# Altium project LP_LED_CUBE_8x8x8.PrjPcb
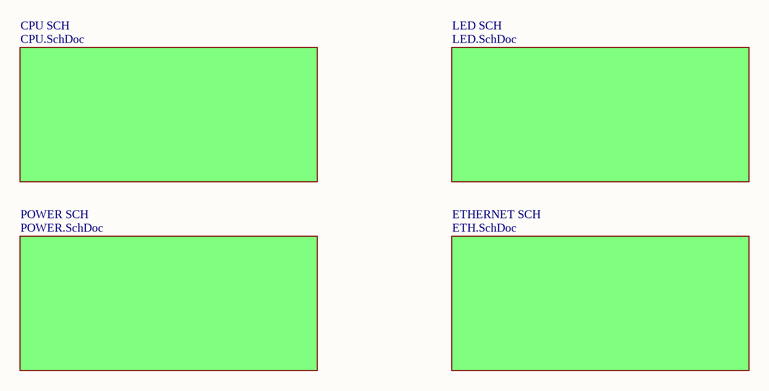
[diagram p0: LP_LED_CUBE_8x8x8.SchDoc]
Title: LED Cube 8x8x8
5 sheets, 171 parts. Net scope: global (net labels, ports and power ports of the same name join across sheets).
Board file: LP_LED_CUBE_8x8x8.PcbDoc
Sheets:
  LP_LED_CUBE_8x8x8.SchDoc
    CPU SCH = CPU.SchDoc
    LED SCH = LED.SchDoc
    POWER SCH = POWER.SchDoc
    ETHERNET SCH = ETH.SchDoc

## Sheet LP_LED_CUBE_8x8x8.SchDoc: LED Cube 8x8x8
size A4

### Sub-sheets
CPU SCH = CPU.SchDoc: no entries
ETHERNET SCH = ETH.SchDoc: no entries
LED SCH = LED.SchDoc: no entries
POWER SCH = POWER.SchDoc: no entries

## Sheet CPU.SchDoc: LED CUBE 8x8x8 - CPU
size A4; Author: Luka Penger; CompanyName: L. Penger; DrawnBy: Luka Penger; Organization: L. Penger; Address1: Luka Penger; Address2: http://lukapenger.eu; Address3: Software & Hardware; Address4: Development; DocumentNumber: 1; Revision: 1.0.0; SheetNumber: 1; SheetTotal: 4; DocumentName: CPU; ImagePath: I:\lp-led-cube-8x8x8\LP_LED_CUBE_8x8x8_PCB\ver_1.0.0; ProjectName: LED CUBE 8x8x8
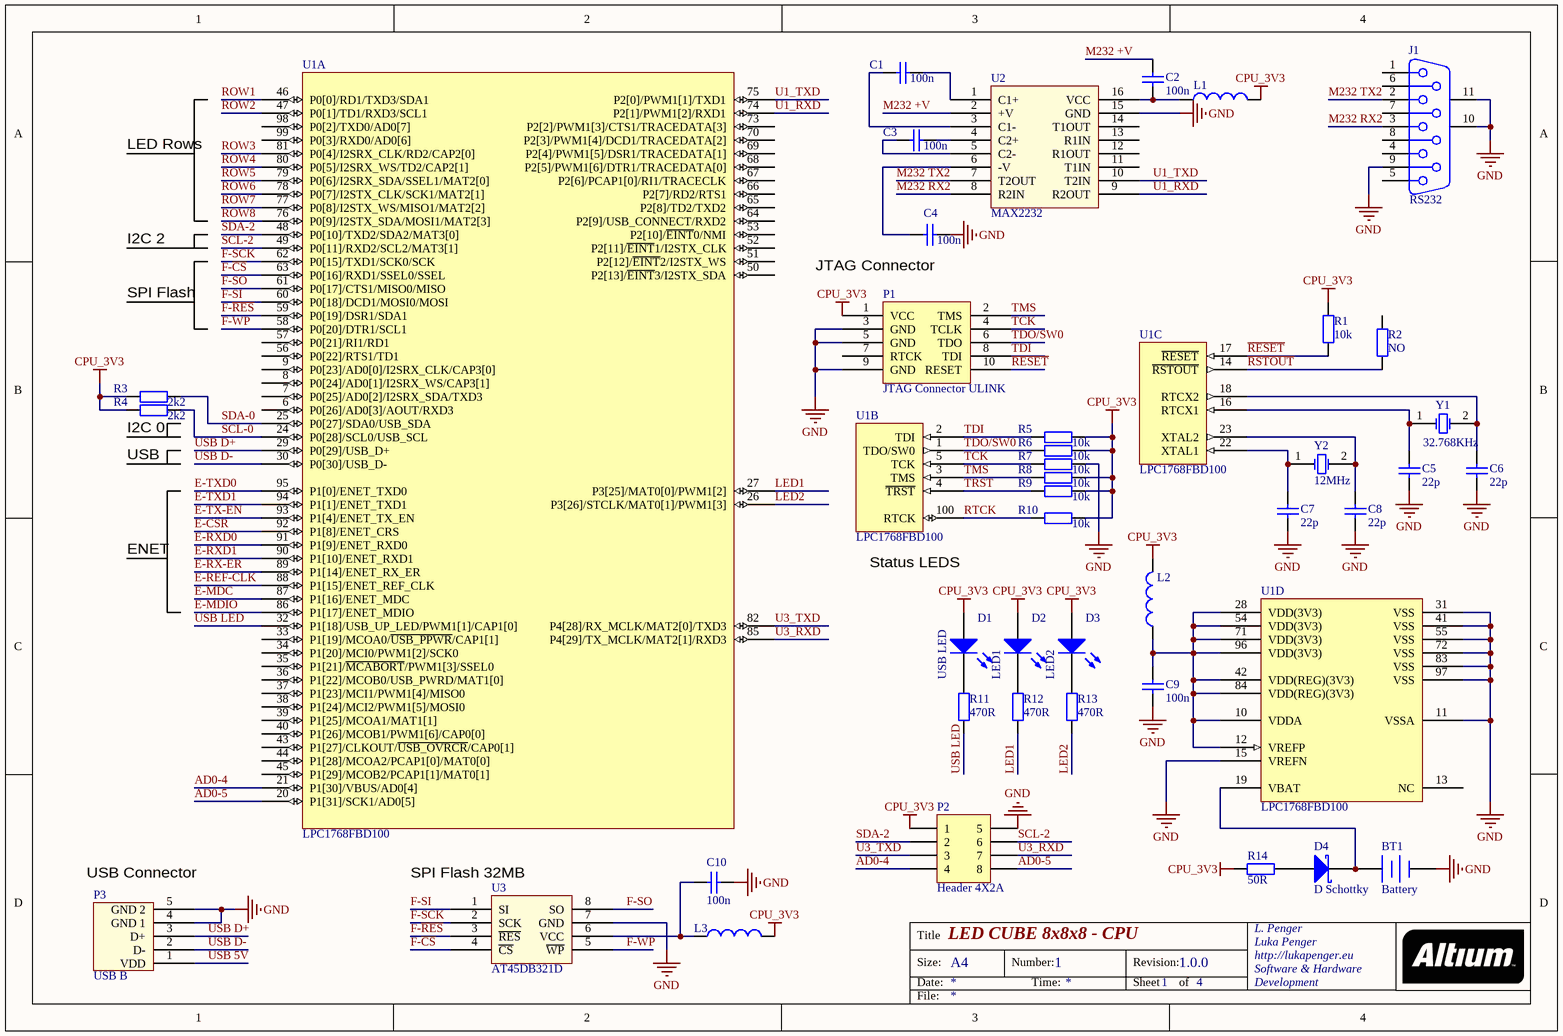
[diagram p1: CPU.SchDoc]

### Parts
BT1  Battery  [Battery CAP]
C1  100n  [1608[0603]]
C2  100n  [1608[0603]]
C3  100n  [1608[0603]]
C4  100n  [1608[0603]]
C5  22p  [1608[0603]]
C6  22p  [1608[0603]]
C7  22p  [1608[0603]]
C8  22p  [1608[0603]]
C9  100n  [1608[0603]]
C10  100n  [1608[0603]]
D1  USB LED  [LED-1]
D2  LED1  [LED-1]
D3  LED2  [LED-1]
D4  D Schottky  [SMB]
J1  RS232  [DSUB1.385-2H9]
L1  Inductor  [1608[0603]]  (value not drawn)
L2  Inductor  [1608[0603]]  (value not drawn)
L3  Inductor  [1608[0603]]  (value not drawn)
P1  JTAG Connector ULINK  [JTAG Connector ULINK]
P2  Header 4X2A  [HDR2X4_CEN]
P3  USB B  [USB B]
R1  10k  [1608[0603]]
R2  NO  [1608[0603]]
R3  2k2  [1608[0603]]
R4  2k2  [1608[0603]]
R5  10k  [1608[0603]]
R6  10k  [1608[0603]]
R7  10k  [1608[0603]]
R8  10k  [1608[0603]]
R9  10k  [1608[0603]]
R10  10k  [1608[0603]]
R11  470R  [1608[0603]]
R12  470R  [1608[0603]]
R13  470R  [1608[0603]]
R14  50R  [1608[0603]]
U1  LPC1768FBD100  [SOT407-1_N]  (parts A,B,C,D of 4)
U2  MAX2232  [SOIC16_N]
U3  AT45DB321D  [AT45DB321D]
Y1  32.768KHz  [Crystal 4.1x1.5]
Y2  12MHz  [5x3.2 Crystal]

### Nets
CPU_3V3: D1.1(A) D2.1(A) D3.1(A) L1.2 L2.2 L3.2 P1.1(VCC) P2.1 R1.2 R3.1 R4.1 R5.2 R6.2 R8.2 R9.2 R10.2 R14.2
GND: BT1.2(-) C4.1 C5.1 C6.1 C7.1 C8.1 C9.1 C10.1 J1.9 J1.10(MH1) J1.11(MH2) P1.3(GND) P1.5(GND) P1.9(GND) P2.5 P3.4(GND_1) P3.5(GND_2) R7.2 U1.11(VSSA) U1.15(VREFN) U1.31(VSS) U1.41(VSS) U1.55(VSS) U1.72(VSS) U1.83(VSS) U1.97(VSS) U2.15(GND) U3.7(GND)
AD0-4: P2.4 U1.21(P1[30]/VBUS/AD0[4])
AD0-5: P2.8 U1.20(P1[31]/SCK1/AD0[5])
E-CSR: U1.92(P1[8]/ENET_CRS)
E-MDC: U1.87(P1[16]/ENET_MDC)
E-MDIO: U1.86(P1[17]/ENET_MDIO)
E-REF-CLK: U1.88(P1[15]/ENET_REF_CLK)
E-RX-ER: U1.89(P1[14]/ENET_RX_ER)
E-RXD0: U1.91(P1[9]/ENET_RXD0)
E-RXD1: U1.90(P1[10]/ENET_RXD1)
E-TX-EN: U1.93(P1[4]/ENET_TX_EN)
E-TXD0: U1.95(P1[0]/ENET_TXD0)
E-TXD1: U1.94(P1[1]/ENET_TXD1)
F-~{CS}: U1.63(P0[16]/RXD1/SSEL0/SSEL) U3.4(~{CS})
F-~{RES}: U1.59(P0[19]/DSR1/SDA1) U3.3(~{RES})
F-SCK: U1.62(P0[15]/TXD1/SCK0/SCK) U3.2(SCK)
F-SI: U1.60(P0[18]/DCD1/MOSI0/MOSI) U3.1(SI)
F-SO: U1.61(P0[17]/CTS1/MISO0/MISO) U3.8(SO)
F-~{WP}: U1.58(P0[20]/DTR1/SCL1) U3.5(~{WP})
LED1: R12.1 U1.27(P3[25]/MAT0[0]/PWM1[2])
LED2: R13.1 U1.26(P3[26]/STCLK/MAT0[1]/PWM1[3])
M232 +V: C2.1 U2.2(+V)
M232 RX2: J1.3 U2.8(R2IN)
M232 TX2: J1.2 U2.7(T2OUT)
~{RESET}: P1.10(RESET) R1.1 U1.17(~{RESET})
~{RSTOUT}: R2.1 U1.14(~{RSTOUT})
ROW1: U1.46(P0[0]/RD1/TXD3/SDA1)
ROW2: U1.47(P0[1]/TD1/RXD3/SCL1)
ROW3: U1.81(P0[4]/I2SRX_CLK/RD2/CAP2[0])
ROW4: U1.80(P0[5]/I2SRX_WS/TD2/CAP2[1])
ROW5: U1.79(P0[6]/I2SRX_SDA/SSEL1/MAT2[0])
ROW6: U1.78(P0[7]/I2STX_CLK/SCK1/MAT2[1])
ROW7: U1.77(P0[8]/I2STX_WS/MISO1/MAT2[2])
ROW8: U1.76(P0[9]/I2STX_SDA/MOSI1/MAT2[3])
RTCK: R10.1 U1.100(RTCK)
SCL-0: R4.2 U1.24(P0[28]/SCL0/USB_SCL)
SCL-2: P2.6 U1.49(P0[11]/RXD2/SCL2/MAT3[1])
SDA-0: R3.2 U1.25(P0[27]/SDA0/USB_SDA)
SDA-2: P2.2 U1.48(P0[10]/TXD2/SDA2/MAT3[0])
TCK: P1.4(TCLK) R7.1 U1.5(TCK)
TDI: P1.8(TDI) R5.1 U1.2(TDI)
TDO/SW0: P1.6(TDO) R6.1 U1.1(TDO/SW0)
TMS: P1.2(TMS) R8.1 U1.3(TMS)
TRST: R9.1 U1.4(~{TRST})
U1_RXD: U1.74(P2[1]/PWM1[2]/RXD1) U2.9(R2OUT)
U1_TXD: U1.75(P2[0]/PWM1[1]/TXD1) U2.10(T2IN)
U3_RXD: P2.7 U1.85(P4[29]/TX_MCLK/MAT2[1]/RXD3)
U3_TXD: P2.3 U1.82(P4[28]/RX_MCLK/MAT2[0]/TXD3)
USB 5V: P3.1(VDD)
USB D+: P3.3(D+) U1.29(P0[29]/USB_D+)
USB D-: P3.2(D-) U1.30(P0[30]/USB_D-)
USB LED: R11.1 U1.32(P1[18]/USB_UP_LED/PWM1[1]/CAP1[0])
NetBT1_1: BT1.1(+) D4.2(K) U1.19(VBAT)
NetC1_1: C1.1 U2.3(C1-)
NetC1_2: C1.2 U2.1(C1+)
NetC2_2: C2.2 L1.1 U2.16(VCC)
NetC3_1: C3.1 U2.5(C2-)
NetC3_2: C3.2 U2.4(C2+)
NetC4_2: C4.2 U2.6(-V)
NetC5_2: C5.2 U1.16(RTCX1) Y1.1(OSC1)
NetC6_2: C6.2 U1.18(RTCX2) Y1.2(OSC2)
NetC7_2: C7.2 U1.22(XTAL1) Y2.1(OSC1)
NetC8_2: C8.2 U1.23(XTAL2) Y2.2(OSC2)
NetC9_2: C9.2 L2.1 U1.10(VDDA) U1.12(VREFP) U1.28(VDD(3V3)) U1.42(VDD(REG)(3V3)) U1.54(VDD(3V3)) U1.71(VDD(3V3)) U1.84(VDD(REG)(3V3)) U1.96(VDD(3V3))
NetC10_2: C10.2 L3.1 U3.6(VCC)
NetD1_2: D1.2(K) R11.2
NetD2_2: D2.2(K) R12.2
NetD3_2: D3.2(K) R13.2
NetD4_1: D4.1(A) R14.1

Not connected (* = marked no-connect by the designer): J1 1 4 5 6 7 8; P1 7(RTCK); R2 2; U1 6(P0[26]/AD0[3]/AOUT/RXD3) 7(P0[25]/AD0[2]/I2SRX_SDA/TXD3) 8(P0[24]/AD0[1]/I2SRX_WS/CAP3[1]) 9(P0[23]/AD0[0]/I2SRX_CLK/CAP3[0]) 13(NC) 33(P1[19]/MCOA0/~{USB_PPWR}/CAP1[1]) 34(P1[20]/MCI0/PWM1[2]/SCK0) 35(P1[21]/~{MCABORT}/PWM1[3]/SSEL0) 36(P1[22]/MCOB0/USB_PWRD/MAT1[0]) 37(P1[23]/MCI1/PWM1[4]/MISO0) 38(P1[24]/MCI2/PWM1[5]/MOSI0) 39(P1[25]/MCOA1/MAT1[1]) 40(P1[26]/MCOB1/PWM1[6]/CAP0[0]) 43(P1[27]/CLKOUT/~{USB_OVRCR}/CAP0[1]) 44(P1[28]/MCOA2/PCAP1[0]/MAT0[0]) 45(P1[29]/MCOB2/PCAP1[1]/MAT0[1]) 50(P2[13]/~{EINT}3/I2STX_SDA) 51(P2[12]/~{EINT}2/I2STX_WS) 52(P2[11]/~{EINT}1/I2STX_CLK) 53(P2[10]/~{EINT}0/NMI) 56(P0[22]/RTS1/TD1) 57(P0[21]/RI1/RD1) 64(P2[9]/USB_CONNECT/RXD2) 65(P2[8]/TD2/TXD2) 66(P2[7]/RD2/RTS1) 67(P2[6]/PCAP1[0]/RI1/TRACECLK) 68(P2[5]/PWM1[6]/DTR1/TRACEDATA[0]) 69(P2[4]/PWM1[5]/DSR1/TRACEDATA[1]) 70(P2[3]/PWM1[4]/DCD1/TRACEDATA[2]) 73(P2[2]/PWM1[3]/CTS1/TRACEDATA[3]) 98(P0[2]/TXD0/AD0[7]) 99(P0[3]/RXD0/AD0[6]); U2 11(T1IN) 12(R1OUT) 13(R1IN) 14(T1OUT)

### Notes on the sheet
- LED Rows
- I2C 2
- SPI Flash
- JTAG Connector
- (near R4) I2C 0
- USB
- ENET
- (near U1) Status LEDS
- (near P3) USB Connector
- (near U3) SPI Flash 32MB
- Title
- Size:
- Date:
- A4
- Number:
- Time:
- Revision:
- Sheet
- of
- File:

### Library data of the parts
BT1 = Battery: Multicell Battery; Published: 24-Mar-1999; LatestRevisionDate: 17-Jul-2002; LatestRevisionNote: Re-released for DXP Platform.; PackageReference: BAT-2; Publisher: Altium Limited; PackageDescription: Battery; 2 Leads
C1-C10 = Cap: Capacitor; Value: 100pF; Published: 8-Jun-2000; LatestRevisionDate: 17-Jul-2002; LatestRevisionNote: Re-released for DXP Platform.; PackageReference: RAD-0.3; Publisher: Altium Limited; PackageDescription: Radial Cap, Thru-Hole; 2 Leads; 0.3 in Pin Spacing
D1-D3 = LED0: Typical INFRARED GaAs LED; Published: 8-Jun-2000; LatestRevisionDate: 08-Jul-2005; LatestRevisionNote: Mech Layer 1 removed.; PackageReference: LED-0; Publisher: Altium Limited; PackageDescription: LED; 2 Leads
D4 = D Schottky: Schottky Diode; Published: 8-Jun-2000; LatestRevisionDate: 17-Jul-2002; LatestRevisionNote: Re-released for DXP Platform.; PackageReference: SMB; Publisher: Altium Limited; PackageDescription: DO-214-AA/SMB; 2 C-Bend Leads; Body 5.3 x 3.6 mm, inc. leads (LxW); Code_JEDEC: DO-214-AA
J1 = D Connector 9: Receptacle Assembly, 9 Position, Right Angle; PackageDocument: O; Positions: 9; Published: 15-Jun-2001; LatestRevisionDate: 17-Jul-2002; LatestRevisionNote: Re-released for DXP Platform.; DatasheetDocument: 1-Sep-1999; PackageReference: 788750; Publisher: Altium Limited; Orientation: Right Angle; Gender: Receptacle
L1-L3 = Inductor: Code_IEC: 1005; Value: 10mH; Published: 8-Jun-2000; LatestRevisionDate: 29-May-2009; LatestRevisionNote: IPC-7351 Footprint Added.; PackageReference: 0402-A; Publisher: Altium Limited; PackageDescription: Chip Inductor; Code_JEITA: 0402
P1 = JTAG Connector ULINK: JTAG Connector
P2 = Header 4X2A: Header, 4-Pin, Dual row; LatestRevisionDate: 17-Jul-2002; LatestRevisionNote: Re-released for DXP Platform.; Publisher: Altium Limited
P3 = USB B: USB Connector
R1-R14 = Res2: Resistor; Value: 1K; Published: 8-Jun-2000; LatestRevisionDate: 17-Jul-2002; LatestRevisionNote: Re-released for DXP Platform.; PackageReference: AXIAL-0.4; Publisher: Altium Limited; PackageDescription: Axial Device, Thru-Hole; 2 Leads; 0.4 in Pin Spacing
U1 = LPC1768FBD100: 32-bit ARM Cortex-M3 microcontroller; up to 512 kB flash and 64 kB SRAM with Ethernet, USB 2.0 Host/Device/OTG, CAN; Code_IEC: 136E20; Published: 17-Aug-2007; DatasheetVersion: rev.01, Jan-2007; PackageVersion: Feb-2003; PackageReference: SOT407-1; Publisher: Altium Limited; PackageDescription: 100-Pin Plastic Low Profile Quad Flat Pack, LQFP100; Code_JEDEC: MS-026; ComponentLink1Description: Manufacturer Link; ComponentLink1URL: http://www.nxp.com/; ComponentLink2Description: Datasheet; ComponentLink2URL: http://www.standardics.nxp.com/products/lpc2000/datasheet/lpc2364.lpc2366.lpc2368.pdf
U2 = MAX2232: Dual 232 +3V3
U3 = AT45DB321D: SPI Flash 32MB
Y1 Y2 = XTAL: Crystal Oscillator; Published: 8-Jun-2000; LatestRevisionDate: 17-Jul-2002; LatestRevisionNote: Re-released for DXP Platform.; PackageReference: R38; Publisher: Altium Limited; PackageDescription: Crystal, Thru-Hole; 2 Leads; Body 3.1 x 8.2 mm (Dia.xH)

## Sheet LED.SchDoc: LED Cube 8x8x8 - LED
size A4; Author: Luka Penger; CompanyName: L. Penger; DrawnBy: Luka Penger; Organization: L. Penger; Address1: Luka Penger; Address2: http://lukapenger.eu; Address3: Software & Hardware; Address4: Development; DocumentNumber: 3; Revision: 1.0.0; SheetNumber: 3; SheetTotal: 4; DocumentName: LED; ProjectName: LED Cube 8x8x8
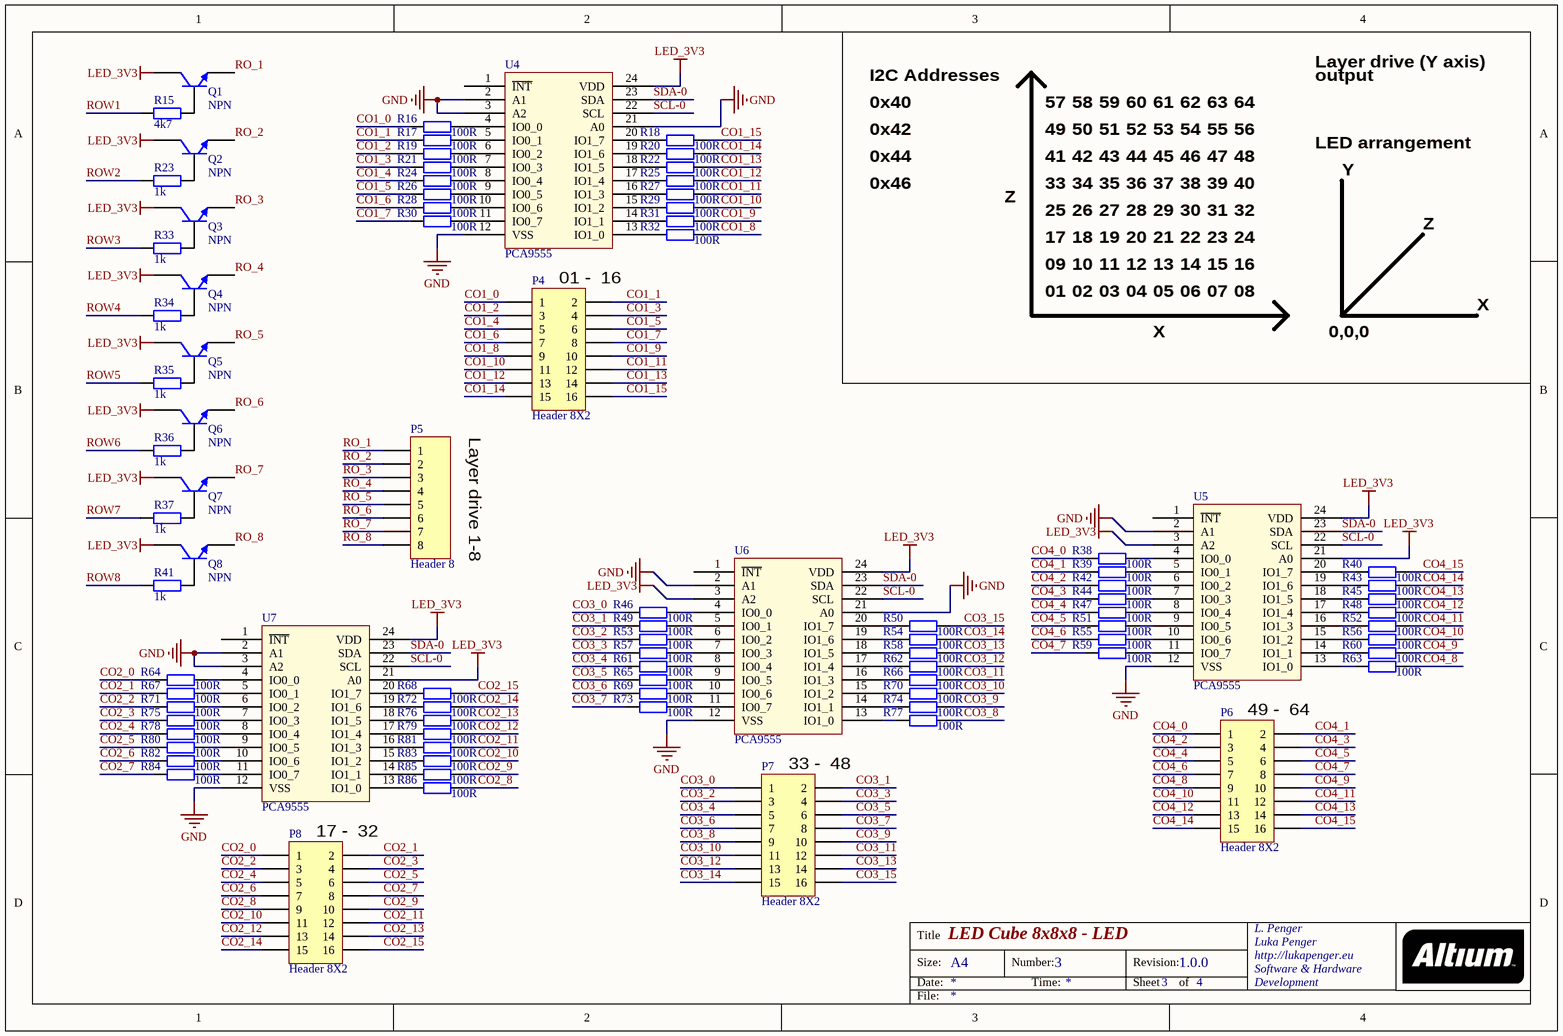
[diagram p2: LED.SchDoc]

### Parts
P4  Header 8X2  [HDR2X8]
P5  Header 8  [HDR1X8]
P6  Header 8X2  [HDR2X8]
P7  Header 8X2  [HDR2X8]
P8  Header 8X2  [HDR2X8]
Q1  NPN  [SOT23_L]
Q2  NPN  [SOT23_L]
Q3  NPN  [SOT23_L]
Q4  NPN  [SOT23_L]
Q5  NPN  [SOT23_L]
Q6  NPN  [SOT23_L]
Q7  NPN  [SOT23_L]
Q8  NPN  [SOT23_L]
R15  4k7  [6-0805_N]
R16  100R  [6-0805_L]
R17  100R  [6-0805_L]
R18  100R  [6-0805_L]
R19  100R  [6-0805_L]
R20  100R  [6-0805_L]
R21  100R  [6-0805_L]
R22  100R  [6-0805_L]
R23  1k  [6-0805_N]
R24  100R  [6-0805_L]
R25  100R  [6-0805_L]
R26  100R  [6-0805_L]
R27  100R  [6-0805_L]
R28  100R  [6-0805_L]
R29  100R  [6-0805_L]
R30  100R  [6-0805_L]
R31  100R  [6-0805_L]
R32  100R  [6-0805_L]
R33  1k  [6-0805_N]
R34  1k  [6-0805_N]
R35  1k  [6-0805_N]
R36  1k  [6-0805_N]
R37  1k  [6-0805_N]
R38  100R  [6-0805_L]
R39  100R  [6-0805_L]
R40  100R  [6-0805_L]
R41  1k  [6-0805_N]
R42  100R  [6-0805_L]
R43  100R  [6-0805_L]
R44  100R  [6-0805_L]
R45  100R  [6-0805_L]
R46  100R  [6-0805_L]
R47  100R  [6-0805_L]
R48  100R  [6-0805_L]
R49  100R  [6-0805_L]
R50  100R  [6-0805_L]
R51  100R  [6-0805_L]
R52  100R  [6-0805_L]
R53  100R  [6-0805_L]
R54  100R  [6-0805_L]
R55  100R  [6-0805_L]
R56  100R  [6-0805_L]
R57  100R  [6-0805_L]
R58  100R  [6-0805_L]
R59  100R  [6-0805_L]
R60  100R  [6-0805_L]
R61  100R  [6-0805_L]
R62  100R  [6-0805_L]
R63  100R  [6-0805_L]
R64  100R  [6-0805_L]
R65  100R  [6-0805_L]
R66  100R  [6-0805_L]
R67  100R  [6-0805_L]
R68  100R  [6-0805_L]
R69  100R  [6-0805_L]
R70  100R  [6-0805_L]
R71  100R  [6-0805_L]
R72  100R  [6-0805_L]
R73  100R  [6-0805_L]
R74  100R  [6-0805_L]
R75  100R  [6-0805_L]
R76  100R  [6-0805_L]
R77  100R  [6-0805_L]
R78  100R  [6-0805_L]
R79  100R  [6-0805_L]
R80  100R  [6-0805_L]
R81  100R  [6-0805_L]
R82  100R  [6-0805_L]
R83  100R  [6-0805_L]
R84  100R  [6-0805_L]
R85  100R  [6-0805_L]
R86  100R  [6-0805_L]
U4  PCA9555  [SSOP24_N]
U5  PCA9555  [SSOP24_N]
U6  PCA9555  [SSOP24_N]
U7  PCA9555  [SSOP24_N]

### Nets
GND: U4.2(A1) U4.3(A2) U4.12(VSS) U4.21(A0) U5.2(A1) U5.12(VSS) U6.2(A1) U6.12(VSS) U6.21(A0) U7.2(A1) U7.3(A2) U7.12(VSS)
LED_3V3: Q1.1(C) Q2.1(C) Q3.1(C) Q4.1(C) Q5.1(C) Q6.1(C) Q7.1(C) Q8.1(C) U4.24(VDD) U5.3(A2) U5.21(A0) U5.24(VDD) U6.3(A2) U6.24(VDD) U7.21(A0) U7.24(VDD)  [project net CPU_3V3]
CO1_0: P4.1 R16.1
CO1_1: P4.2 R17.1
CO1_2: P4.3 R19.1
CO1_3: P4.4 R21.1
CO1_4: P4.5 R24.1
CO1_5: P4.6 R26.1
CO1_6: P4.7 R28.1
CO1_7: P4.8 R30.1
CO1_8: P4.9 R32.2
CO1_9: P4.10 R31.2
CO1_10: P4.11 R29.2
CO1_11: P4.12 R27.2
CO1_12: P4.13 R25.2
CO1_13: P4.14 R22.2
CO1_14: P4.15 R20.2
CO1_15: P4.16 R18.2
CO2_0: P8.1 R64.1
CO2_1: P8.2 R67.1
CO2_2: P8.3 R71.1
CO2_3: P8.4 R75.1
CO2_4: P8.5 R78.1
CO2_5: P8.6 R80.1
CO2_6: P8.7 R82.1
CO2_7: P8.8 R84.1
CO2_8: P8.9 R86.2
CO2_9: P8.10 R85.2
CO2_10: P8.11 R83.2
CO2_11: P8.12 R81.2
CO2_12: P8.13 R79.2
CO2_13: P8.14 R76.2
CO2_14: P8.15 R72.2
CO2_15: P8.16 R68.2
CO3_0: P7.1 R46.1
CO3_1: P7.2 R49.1
CO3_2: P7.3 R53.1
CO3_3: P7.4 R57.1
CO3_4: P7.5 R61.1
CO3_5: P7.6 R65.1
CO3_6: P7.7 R69.1
CO3_7: P7.8 R73.1
CO3_8: P7.9 R77.2
CO3_9: P7.10 R74.2
CO3_10: P7.11 R70.2
CO3_11: P7.12 R66.2
CO3_12: P7.13 R62.2
CO3_13: P7.14 R58.2
CO3_14: P7.15 R54.2
CO3_15: P7.16 R50.2
CO4_0: P6.1 R38.1
CO4_1: P6.2 R39.1
CO4_2: P6.3 R42.1
CO4_3: P6.4 R44.1
CO4_4: P6.5 R47.1
CO4_5: P6.6 R51.1
CO4_6: P6.7 R55.1
CO4_7: P6.8 R59.1
CO4_8: P6.9 R63.2
CO4_9: P6.10 R60.2
CO4_10: P6.11 R56.2
CO4_11: P6.12 R52.2
CO4_12: P6.13 R48.2
CO4_13: P6.14 R45.2
CO4_14: P6.15 R43.2
CO4_15: P6.16 R40.2
RO_1: P5.1 Q1.3(E)
RO_2: P5.2 Q2.3(E)
RO_3: P5.3 Q3.3(E)
RO_4: P5.4 Q4.3(E)
RO_5: P5.5 Q5.3(E)
RO_6: P5.6 Q6.3(E)
RO_7: P5.7 Q7.3(E)
RO_8: P5.8 Q8.3(E)
ROW1: R15.2
ROW2: R23.2
ROW3: R33.2
ROW4: R34.2
ROW5: R35.2
ROW6: R36.2
ROW7: R37.2
ROW8: R41.2
SCL-0: U4.22(SCL) U5.22(SCL) U6.22(SCL) U7.22(SCL)
SDA-0: U4.23(SDA) U5.23(SDA) U6.23(SDA) U7.23(SDA)
NetQ1_2: Q1.2(B) R15.1
NetQ2_2: Q2.2(B) R23.1
NetQ3_2: Q3.2(B) R33.1
NetQ4_2: Q4.2(B) R34.1
NetQ5_2: Q5.2(B) R35.1
NetQ6_2: Q6.2(B) R36.1
NetQ7_2: Q7.2(B) R37.1
NetQ8_2: Q8.2(B) R41.1
NetR16_2: R16.2 U4.4(IO0_0)
NetR17_2: R17.2 U4.5(IO0_1)
NetR18_1: R18.1 U4.20(IO1_7)
NetR19_2: R19.2 U4.6(IO0_2)
NetR20_1: R20.1 U4.19(IO1_6)
NetR21_2: R21.2 U4.7(IO0_3)
NetR22_1: R22.1 U4.18(IO1_5)
NetR24_2: R24.2 U4.8(IO0_4)
NetR25_1: R25.1 U4.17(IO1_4)
NetR26_2: R26.2 U4.9(IO0_5)
NetR27_1: R27.1 U4.16(IO1_3)
NetR28_2: R28.2 U4.10(IO0_6)
NetR29_1: R29.1 U4.15(IO1_2)
NetR30_2: R30.2 U4.11(IO0_7)
NetR31_1: R31.1 U4.14(IO1_1)
NetR32_1: R32.1 U4.13(IO1_0)
NetR38_2: R38.2 U5.4(IO0_0)
NetR39_2: R39.2 U5.5(IO0_1)
NetR40_1: R40.1 U5.20(IO1_7)
NetR42_2: R42.2 U5.6(IO0_2)
NetR43_1: R43.1 U5.19(IO1_6)
NetR44_2: R44.2 U5.7(IO0_3)
NetR45_1: R45.1 U5.18(IO1_5)
NetR46_2: R46.2 U6.4(IO0_0)
NetR47_2: R47.2 U5.8(IO0_4)
NetR48_1: R48.1 U5.17(IO1_4)
NetR49_2: R49.2 U6.5(IO0_1)
NetR50_1: R50.1 U6.20(IO1_7)
NetR51_2: R51.2 U5.9(IO0_5)
NetR52_1: R52.1 U5.16(IO1_3)
NetR53_2: R53.2 U6.6(IO0_2)
NetR54_1: R54.1 U6.19(IO1_6)
NetR55_2: R55.2 U5.10(IO0_6)
NetR56_1: R56.1 U5.15(IO1_2)
NetR57_2: R57.2 U6.7(IO0_3)
NetR58_1: R58.1 U6.18(IO1_5)
NetR59_2: R59.2 U5.11(IO0_7)
NetR60_1: R60.1 U5.14(IO1_1)
NetR61_2: R61.2 U6.8(IO0_4)
NetR62_1: R62.1 U6.17(IO1_4)
NetR63_1: R63.1 U5.13(IO1_0)
NetR64_2: R64.2 U7.4(IO0_0)
NetR65_2: R65.2 U6.9(IO0_5)
NetR66_1: R66.1 U6.16(IO1_3)
NetR67_2: R67.2 U7.5(IO0_1)
NetR68_1: R68.1 U7.20(IO1_7)
NetR69_2: R69.2 U6.10(IO0_6)
NetR70_1: R70.1 U6.15(IO1_2)
NetR71_2: R71.2 U7.6(IO0_2)
NetR72_1: R72.1 U7.19(IO1_6)
NetR73_2: R73.2 U6.11(IO0_7)
NetR74_1: R74.1 U6.14(IO1_1)
NetR75_2: R75.2 U7.7(IO0_3)
NetR76_1: R76.1 U7.18(IO1_5)
NetR77_1: R77.1 U6.13(IO1_0)
NetR78_2: R78.2 U7.8(IO0_4)
NetR79_1: R79.1 U7.17(IO1_4)
NetR80_2: R80.2 U7.9(IO0_5)
NetR81_1: R81.1 U7.16(IO1_3)
NetR82_2: R82.2 U7.10(IO0_6)
NetR83_1: R83.1 U7.15(IO1_2)
NetR84_2: R84.2 U7.11(IO0_7)
NetR85_1: R85.1 U7.14(IO1_1)
NetR86_1: R86.1 U7.13(IO1_0)

Not connected (* = marked no-connect by the designer): U4 1(~{INT}); U5 1(~{INT}); U6 1(~{INT}); U7 1(~{INT})

### Notes on the sheet
- I2C Addresses
- 0x40
- 57
- 58
- 59
- 60
- 61
- 62
- 63
- 64
- Layer drive (Y axis)
- output
- 0x42
- 0x44
- 41
- 49
- 42
- 50
- 43
- 51
- 44
- 52
- 45
- 53
- 46
- 54
- 47
- 55
- 48
- 56
- LED arrangement
- Y
- 0x46
- Z
- 17
- 25
- 33
- 18
- 26
- 34
- 19
- 27
- 35
- 20
- 28
- 36
- 21
- 29
- 37
- 22
- 30
- 38
- 23
- 31
- 39
- 24
- 32
- 40
- (near P4) 01 -  16
- 01
- 09
- 02
- 10
- 03
- 11
- 04
- 12
- 05
- 13
- 06
- 14
- 07
- 15
- 08
- 16
- X
- 0,0,0
- Layer drive 1-8
- (near P6) 49 -  64
- (near P7) 33 -  48
- (near P8) 17 -  32
- Title
- Size:
- Date:
- A4
- Number:
- Time:
- Revision:
- Sheet
- of
- File:

### Library data of the parts
P4 P6-P8 = Header 8X2: Header, 8-Pin, Dual row; LatestRevisionDate: 17-Jul-2002; LatestRevisionNote: Re-released for DXP Platform.; Publisher: Altium Limited
P5 = Header 8: Header, 8-Pin; LatestRevisionDate: 17-Jul-2002; LatestRevisionNote: Re-released for DXP Platform.; Publisher: Altium Limited
Q1-Q8 = NPN: NPN Bipolar Transistor; Published: 8-Jun-2000; LatestRevisionDate: 17-Jul-2002; LatestRevisionNote: Re-released for DXP Platform.; PackageReference: TO-226-AA; Publisher: Altium Limited; PackageDescription: TO, Flat Index; 3 In-Line, Axial Leads; Body Dia. 4.8mm; Leads 0.55 x 0.51 mm (max); Code_JEDEC: TO-226-AA
R15-R22 R24-R32 R38-R40 R42-R86 = Res2: Resistor; Value: 1K; Published: 8-Jun-2000; LatestRevisionDate: 17-Jul-2002; LatestRevisionNote: Re-released for DXP Platform.; PackageReference: AXIAL-0.4; Publisher: Altium Limited; PackageDescription: Axial Device, Thru-Hole; 2 Leads; 0.4 in Pin Spacing
R23 R33-R37 R41 = Res2: Resistor; Published: 8-Jun-2000; LatestRevisionDate: 17-Jul-2002; LatestRevisionNote: Re-released for DXP Platform.; PackageReference: AXIAL-0.4; Publisher: Altium Limited; PackageDescription: Axial Device, Thru-Hole; 2 Leads; 0.4 in Pin Spacing; Value: 1K
U4-U7 = PCA9555: I2C I/O Ports

## Sheet POWER.SchDoc: LED Cube 8x8x8 - POWER
size A4; Author: Luka Penger; CompanyName: L. Penger; DrawnBy: Luka Penger; Organization: L. Penger; Address1: Luka Penger; Address2: http://lukapenger.eu; Address3: Software & Hardware; Address4: Development; DocumentNumber: 2; Revision: 1.0.0; SheetNumber: 2; SheetTotal: 4; DocumentName: POWER; ProjectName: LED Cube 8x8x8
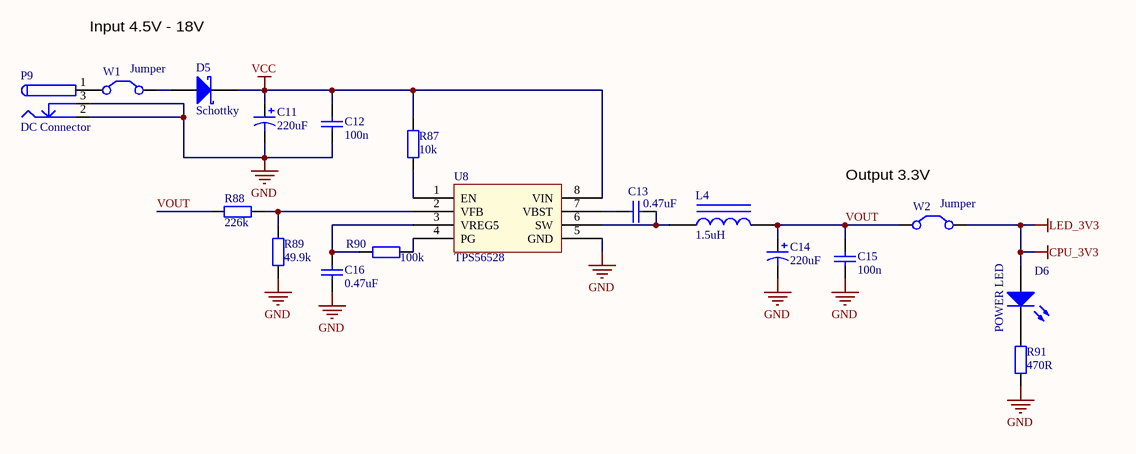
[diagram p3: POWER.SchDoc]

### Parts
C11  220uF  [SMD CAPACITOR 220uF]
C12  100n  [1608[0603]]
C13  0.47uF  [1608[0603]]
C14  220uF  [SMD CAPACITOR 220uF]
C15  100n  [1608[0603]]
C16  0.47uF  [1608[0603]]
D5  Schottky  [SMB]
D6  POWER LED  [LED-1]
L4  1.5uH  [Inductor]
P9  DC Connector  [DC Connector]
R87  10k  [1608[0603]]
R88  226k  [1608[0603]]
R89  49.9k  [1608[0603]]
R90  100k  [1608[0603]]
R91  470R  [1608[0603]]
U8  TPS56528  [TPS56528]
W1  Jumper  [HDR1X2]
W2  Jumper  [HDR1X2]

### Nets
CPU_3V3: D6.1(A) W2.2(C2)  [also labelled LED_3V3]
GND: C11.2 C12.2 C14.2 C15.2 C16.2 P9.2 P9.3 R89.1 R91.1 U8.5(GND)
VCC: C11.1 C12.1 D5.2(K) R87.2 U8.8(VIN)
VOUT: C14.1 C15.1 L4.2 R88.2 W2.1(C1)
NetC13_1: C13.1 U8.7(VBST)
NetC13_2: C13.2 L4.1 U8.6(SW)
NetC16_1: C16.1 R90.2 U8.3(VREG5)
NetD5_1: D5.1(A) W1.2(C2)
NetD6_2: D6.2(K) R91.2
NetP9_1: P9.1 W1.1(C1)
NetR87_1: R87.1 U8.1(EN)
NetR88_1: R88.1 R89.2 U8.2(VFB)
NetR90_1: R90.1 U8.4(PG)

### Notes on the sheet
- Input 4.5V - 18V
- (near W2) Output 3.3V
- Title
- Size:
- Date:
- A4
- Number:
- Time:
- Revision:
- Sheet
- of
- File:

### Library data of the parts
C11 C14 = Cap Pol1: Capacitor; Value: 100pF; Published: 8-Jun-2000; LatestRevisionDate: 17-Jul-2002; LatestRevisionNote: Re-released for DXP Platform.; PackageReference: RB7.6-15; Publisher: Altium Limited; PackageDescription: Polarized Capacitor (Radial); 2 Leads
C12 C13 C15 C16 = Cap: Capacitor; Value: 100pF; Published: 8-Jun-2000; LatestRevisionDate: 17-Jul-2002; LatestRevisionNote: Re-released for DXP Platform.; PackageReference: RAD-0.3; Publisher: Altium Limited; PackageDescription: Radial Cap, Thru-Hole; 2 Leads; 0.3 in Pin Spacing
D5 = D Schottky: Schottky Diode; Published: 8-Jun-2000; LatestRevisionDate: 17-Jul-2002; LatestRevisionNote: Re-released for DXP Platform.; PackageReference: SMB; Publisher: Altium Limited; PackageDescription: DO-214-AA/SMB; 2 C-Bend Leads; Body 5.3 x 3.6 mm, inc. leads (LxW); Code_JEDEC: DO-214-AA
D6 = LED0: Typical INFRARED GaAs LED; Published: 8-Jun-2000; LatestRevisionDate: 08-Jul-2005; LatestRevisionNote: Mech Layer 1 removed.; PackageReference: LED-0; Publisher: Altium Limited; PackageDescription: LED; 2 Leads
L4 = Inductor Iron: Magnetic-Core Inductor; Value: 10mH; Published: 24-Mar-1999; LatestRevisionDate: 17-Jul-2002; LatestRevisionNote: Re-released for DXP Platform.; PackageReference: AXIAL-0.9; Publisher: Altium Limited; PackageDescription: Axial Device, Thru-Hole; 2 Leads; 0.9 in Pin Spacing
P9 = DC Connector: DC Power Connector
R87-R91 = Res2: Resistor; Value: 1K; Published: 8-Jun-2000; LatestRevisionDate: 17-Jul-2002; LatestRevisionNote: Re-released for DXP Platform.; PackageReference: AXIAL-0.4; Publisher: Altium Limited; PackageDescription: Axial Device, Thru-Hole; 2 Leads; 0.4 in Pin Spacing
U8 = TPS56528: Step-Down Converter 5A 4.5V-18V
W1 W2 = Jumper: Jumper Wire; Published: 24-Mar-1999; LatestRevisionDate: 17-Jul-2002; LatestRevisionNote: Re-released for DXP Platform.; PackageReference: RAD-0.2; Publisher: Altium Limited; PackageDescription: Radial Cap, Thru-Hole; 2 Leads; 0.2 in Pin Spacing

## Sheet ETH.SchDoc: LED Cube 8x8x8 - Ethernet
size A4; Author: Luka Penger; CompanyName: L. Penger; DrawnBy: Luka Penger; Organization: L. Penger; Address1: Luka Penger; Address2: http://lukapenger.eu; Address3: Software & Hardware; Address4: Development; DocumentNumber: 4; Revision: 1.0.0; SheetNumber: 4; SheetTotal: 4; DocumentName: ETH; ProjectName: LED Cube 8x8x8
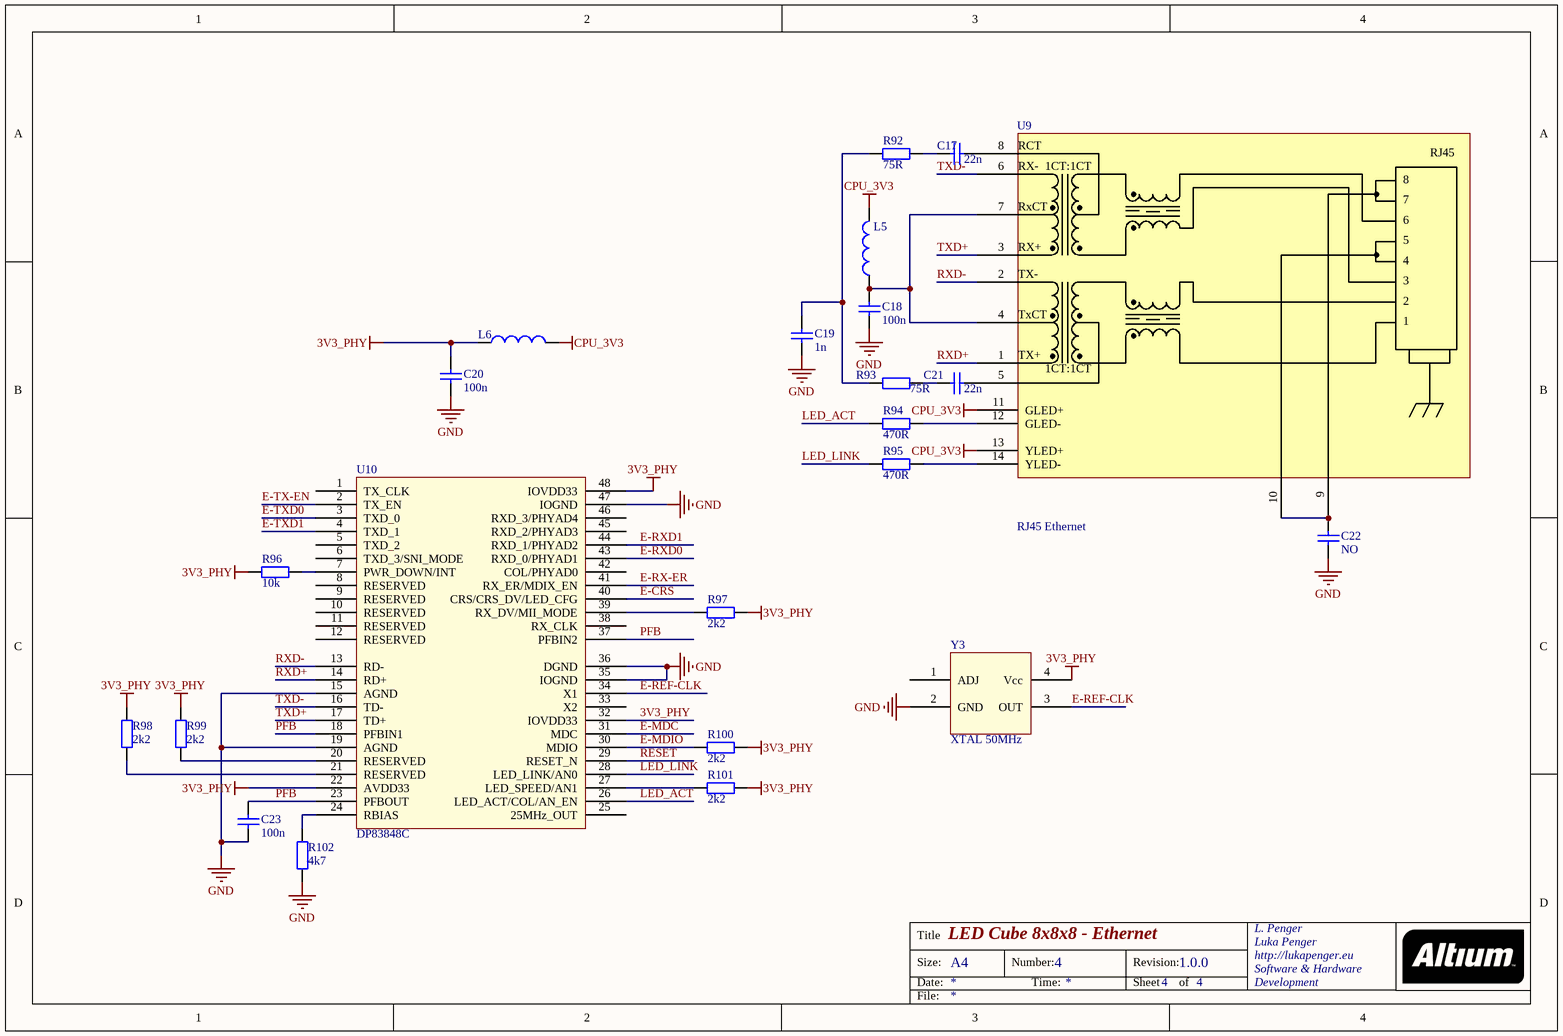
[diagram p4: ETH.SchDoc]

### Parts
C17  22n  [1608[0603]]
C18  100n  [1608[0603]]
C19  1n  [1608[0603]]
C20  100n  [1608[0603]]
C21  22n  [1608[0603]]
C22  NO  [1608[0603]]
C23  100n  [6-0805_L]
L5  Inductor  [1608[0603]]  (value not drawn)
L6  Inductor  [1608[0603]]  (value not drawn)
R92  75R  [1608[0603]]
R93  75R  [1608[0603]]
R94  470R  [1608[0603]]
R95  470R  [1608[0603]]
R96  10k  [1608[0603]]
R97  2k2  [1608[0603]]
R98  2k2  [1608[0603]]
R99  2k2  [1608[0603]]
R100  2k2  [1608[0603]]
R101  2k2  [1608[0603]]
R102  4k7  [1608[0603]]
U9  RJ45 Ethernet  [RJ45 Ethernet connector]
U10  DP83848C  [DP83848C]
Y3  XTAL 50MHz  [XTAL ACT9200]

### Nets
3V3_PHY: C20.1 L6.1 R96.2 R97.1 R98.1 R99.2 R100.1 R101.1 U10.22(AVDD33) U10.32(IOVDD33) U10.48(IOVDD33) Y3.4(Vcc)
CPU_3V3: L5.2 L6.2 U9.11(GLED+) U9.13(YLED+)
GND: C18.2 C19.2 C20.2 C22.1 C23.2 R102.2 U10.15(AGND) U10.19(AGND) U10.35(IOGND) U10.36(DGND) U10.47(IOGND) Y3.2(GND)
E-CRS: U10.40(CRS/CRS_DV/LED_CFG)
E-MDC: U10.31(MDC)
E-MDIO: R100.2 U10.30(MDIO)
E-REF-CLK: U10.34(X1) Y3.3(OUT)
E-RX-ER: U10.41(RX_ER/MDIX_EN)
E-RXD0: U10.43(RXD_0/PHYAD1)
E-RXD1: U10.44(RXD_1/PHYAD2)
E-TX-EN: U10.2(TX_EN)
E-TXD0: U10.3(TXD_0)
E-TXD1: U10.4(TXD_1)
LED_ACT: R94.2 U10.26(LED_ACT/COL/AN_EN)
LED_LINK: R95.2 U10.28(LED_LINK/AN0)
PFB: C23.1 U10.18(PFBIN1) U10.23(PFBOUT) U10.37(PFBIN2)
~{RESET}: U10.29(RESET_N)
RXD+: U9.1 U10.14(RD+)
RXD-: U9.2 U10.13(RD-)
TXD+: U9.3 U10.17(TD+)
TXD-: U9.6 U10.16(TD-)
NetC17_1: C17.1 U9.8
NetC17_2: C17.2 R92.1
NetC18_1: C18.1 L5.1 U9.4 U9.7
NetC19_1: C19.1 R92.2 R93.1
NetC21_1: C21.1 U9.5
NetC21_2: C21.2 R93.2
NetC22_2: C22.2 U9.9 U9.10
NetR94_1: R94.1 U9.12(GLED-)
NetR95_1: R95.1 U9.14(YLED-)
NetR96_1: R96.1 U10.7(PWR_DOWN/INT)
NetR97_2: R97.2 U10.39(RX_DV/MII_MODE)
NetR98_2: R98.2 U10.21(RESERVED)
NetR99_1: R99.1 U10.20(RESERVED)
NetR101_2: R101.2 U10.27(LED_SPEED/AN1)
NetR102_1: R102.1 U10.24(RBIAS)

Not connected (* = marked no-connect by the designer): U10 1(TX_CLK) 5(TXD_2) 6(TXD_3/SNI_MODE) 8(RESERVED) 9(RESERVED) 10(RESERVED) 11(RESERVED) 12(RESERVED) 25(25MHz_OUT) 33(X2) 38(RX_CLK) 42(COL/PHYAD0) 45(RXD_2/PHYAD3) 46(RXD_3/PHYAD4); Y3 1(ADJ)

### Notes on the sheet
- Title
- Size:
- Date:
- A4
- Number:
- Time:
- Revision:
- Sheet
- of
- File:
- (in symbol RJ45 Ethernet) RCT; RJ45; RX-; 1CT:1CT; RxCT; RX+; TX-; TxCT; TX+

### Library data of the parts
C17-C23 = Cap: Capacitor; Value: 100pF; Published: 8-Jun-2000; LatestRevisionDate: 17-Jul-2002; LatestRevisionNote: Re-released for DXP Platform.; PackageReference: RAD-0.3; Publisher: Altium Limited; PackageDescription: Radial Cap, Thru-Hole; 2 Leads; 0.3 in Pin Spacing
L5 L6 = Inductor: Code_IEC: 1005; Value: 10mH; Published: 8-Jun-2000; LatestRevisionDate: 29-May-2009; LatestRevisionNote: IPC-7351 Footprint Added.; PackageReference: 0402-A; Publisher: Altium Limited; PackageDescription: Chip Inductor; Code_JEITA: 0402
R92-R102 = Res2: Resistor; Value: 1K; Published: 8-Jun-2000; LatestRevisionDate: 17-Jul-2002; LatestRevisionNote: Re-released for DXP Platform.; PackageReference: AXIAL-0.4; Publisher: Altium Limited; PackageDescription: Axial Device, Thru-Hole; 2 Leads; 0.4 in Pin Spacing
U9 = RJ45 Ethernet: Ethernet Connector
U10 = DP83848C: Ethernet PHY
Y3 = XTAL ACT9200

## Nets that join several sheets
CPU_3V3: CPU (17 pins), LED (16 pins), POWER (D6.1 W2.2), ETH (L5.2 L6.2 U9.11 U9.13)
GND: CPU (28 pins), LED (12 pins), POWER (10 pins), ETH (12 pins)
E-MDC: CPU (U1.87), ETH (U10.31)
E-MDIO: CPU (U1.86), ETH (R100.2 U10.30)
E-REF-CLK: CPU (U1.88), ETH (U10.34 Y3.3)
E-RX-ER: CPU (U1.89), ETH (U10.41)
E-RXD0: CPU (U1.91), ETH (U10.43)
E-RXD1: CPU (U1.90), ETH (U10.44)
E-TX-EN: CPU (U1.93), ETH (U10.2)
E-TXD0: CPU (U1.95), ETH (U10.3)
E-TXD1: CPU (U1.94), ETH (U10.4)
~{RESET}: CPU (P1.10 R1.1 U1.17), ETH (U10.29)
ROW1: CPU (U1.46), LED (R15.2)
ROW2: CPU (U1.47), LED (R23.2)
ROW3: CPU (U1.81), LED (R33.2)
ROW4: CPU (U1.80), LED (R34.2)
ROW5: CPU (U1.79), LED (R35.2)
ROW6: CPU (U1.78), LED (R36.2)
ROW7: CPU (U1.77), LED (R37.2)
ROW8: CPU (U1.76), LED (R41.2)
SCL-0: CPU (R4.2 U1.24), LED (U4.22 U5.22 U6.22 U7.22)
SDA-0: CPU (R3.2 U1.25), LED (U4.23 U5.23 U6.23 U7.23)